# EAGLE schematic lipo-charger-SMD (EAGLE 6.1)
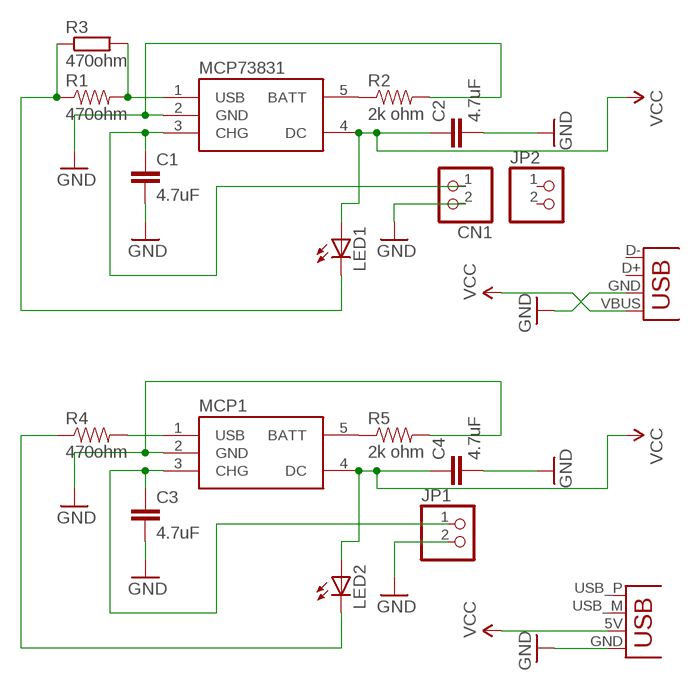
[diagram p0: schematic, sheet 1]

## Parts
C1  4.7uF  CAP0805  [0805]
C2  4.7uF  CAP0805  [0805]
C3  4.7uF  CAP0805  [0805]
C4  4.7uF  CAP0805  [0805]
CN1  JST_2PIN-THM  [JST-PH-2-THM]
JP1  PINHD-1X2/90  [1X02/90]
JP2  PINHD-1X2/90  [1X02/90]
LED1  LEDCHIP-LED0805  [CHIP-LED0805]
LED2  LEDCHIP-LED0805  [CHIP-LED0805]
MCP1  MAX1555  [SOT23-5]
MCP73831  MAX1555  [SOT23-5]
R1  470ohm  RESISTOR  [0805]
R2  2k ohm  RESISTOR  [0805]
R3  470ohm  R-EU_0309/V  [0309V]
R4  470ohm  RESISTOR  [0805]
R5  2k ohm  RESISTOR  [0805]
X2  USB-A-H  [USB-A-H]
X3  USBPCB  [USB-A-PCB]

## Nets
GND: C1.2 C2.2 C3.2 C4.2 CN1.2 JP1.2 MCP1.2(GND) MCP73831.2(GND) R2.2 R5.2 X2.GND(VBUS) X3.GND
N$1: MCP73831.5(BATT) R2.1
N$2: MCP1.5(BATT) R5.1
N$3: C1.1 CN1.1 MCP73831.3(CHG)
N$4: LED1.C R1.1 R3.1
N$5: MCP73831.1(USB) R1.2 R3.2
N$6: C3.1 JP1.1 MCP1.3(CHG)
N$7: LED2.C R4.1
N$8: MCP1.1(USB) R4.2
VCC: C2.1 C4.1 LED1.A LED2.A MCP1.4(DC) MCP73831.4(DC) X2.VBUS(GND) X3.5V(VBUS)
Unconnected: JP2.1 JP2.2 X2.D+(D-) X2.D-(D+) X3.USB_M(D-) X3.USB_P(D+)

## Library data of the parts
C1-C4 = SparkFun:CAP: Capacitor Standard 0603 ceramic capacitor, and 0.1" leaded capacitor.
CN1 = adafruit:JST_2PIN: JST 2-Pin Connectors of various flavors SMT-RA (S2B-PH-SM4) 4UConnector #17311 SMT (B2B-PH-SM4) THM-RA (S2B-PH) THM (B2B-PH)
JP1 JP2 = pinhead:PINHD-1X2: PIN HEADER
LED1 LED2 = adafruit:LED: LED OSRAM: - CHIPLED LG R971, LG N971, LY N971, LG Q971, LY Q971, LO R971, LY R971 LH N974, LH R974 LS Q976, LO Q976, LY Q976 LO Q996 - Hyper CHIPLED LW Q18S LB Q993, LB Q99A, LB R99A - SideLED LS A670, LO A670, LY A670, LG A670, LP A670 LB A673, LV A673, LT A673, LW A673 LH A674 LY A675 LS A676, LA A676, LO A676, LY A676, LW A676 LS A679, LY A679, LG A679 - Hyper Micro SIDELED® LS Y876, LA Y876, LO Y876, LY Y876 LT Y87S - SmartLED LW L88C, LW L88S LB L89C, LB L89S, LG L890 LS L89K, LO L89K, LY L89K LS L896, LA L896, LO L896, LY L896 - TOPLED LS T670, LO T670, LY T670, LG T670, LP T670 LSG T670, LSP T670, LSY T670, LOP T670, LYG T670 LG T671, LOG T671, LSG T671 LB T673, LV T673, LT T673, LW T673 LH T674 LS T676, LA T676, LO T676, LY T676, LB T676, LH T676, LSB T676, LW T676 LB T67C, LV T67C, LT T67C, LS T67K, LO T67K, LY T67K, LW E67C LS E67B, LA E67B, LO E67B, LY E67B, LB E67C, LV E67C, LT E67C LW T67C LS T679, LY T679, LG T679 LS T770, LO T770, LY T770, LG T770, LP T770 LB T773, LV T773, LT T773, LW T773 LH T774 LS E675, LA E675, LY E675, LS T675 LS T776, LA T776, LO T776, LY T776, LB T776 LHGB T686 LT T68C, LB T68C - Hyper Mini TOPLED® LB M676 - Mini TOPLED Santana® LG M470 LS M47K, LO M47K, LY M47K Source: http://www.osram.convergy.de/
MCP1 MCP73831 = SparkFun:MAX1555: MAX1555 Lithium Charger IC SOT-23 Lithium Polymer charging IC. Schematic element and footprint proven. Spark Fun Electronics SKU : COM-00674
R1 R2 R4 R5 = SparkFun:RESISTOR: Resistor Basic schematic elements and footprints for 0603, 1206, and PTH 1/10th watt (small) resistors.
R3 = rcl:R-EU_: RESISTOR, European symbol
X2 X3 = SparkFun:USB: USB Connectors USB-B-PTH is fully proven SKU : PRT-00139 USB-miniB is fully proven SKU : PRT-00587 USB-A-PCB is untested. USB-A-H is throughly reviewed, but untested. Spark Fun Electronics SKU : PRT-00437 USB-B-SMT is throughly reviewed, but untested. Needs silkscreen touching up. USB-A-S has not been used/tested USB-MB-H has not been used/tested